# EAGLE schematic Adafruit USB Isolator (EAGLE 9.3.0)
COMPANY: ADAFRUIT INDUSTRIES; DRAWN: KTOWN; REV: B
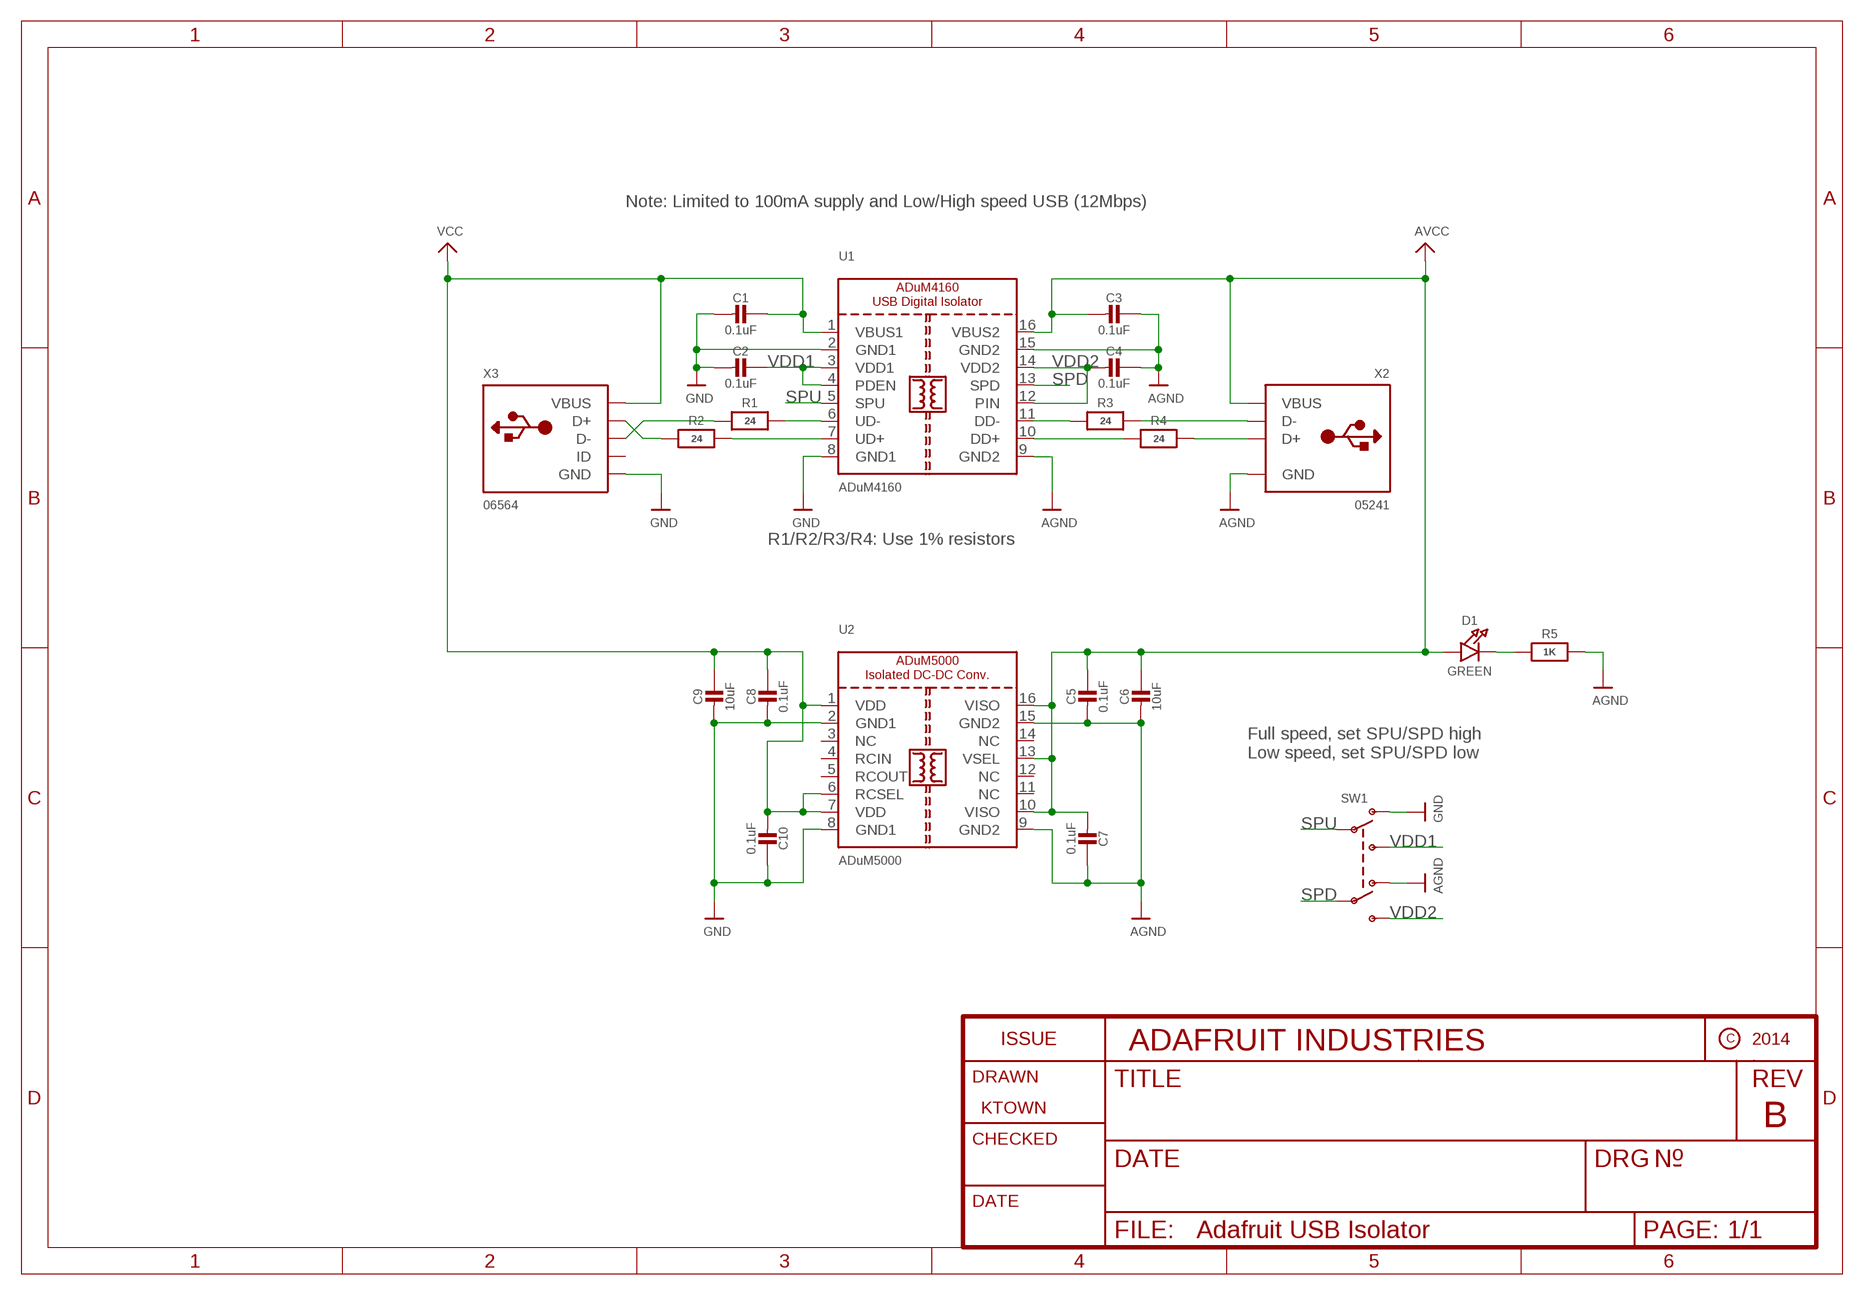
[diagram p0: schematic, sheet 1]

## Parts
C1  0.1uF  CAP_CERAMIC0805-NOOUTLINE  [0805-NO]
C2  0.1uF  CAP_CERAMIC0805-NOOUTLINE  [0805-NO]
C3  0.1uF  CAP_CERAMIC0805-NOOUTLINE  [0805-NO]
C4  0.1uF  CAP_CERAMIC0805-NOOUTLINE  [0805-NO]
C5  0.1uF  CAP_CERAMIC0805-NOOUTLINE  [0805-NO]
C6  10uF  CAP_CERAMIC0805-NOOUTLINE  [0805-NO]
C7  0.1uF  CAP_CERAMIC0805-NOOUTLINE  [0805-NO]
C8  0.1uF  CAP_CERAMIC0805-NOOUTLINE  [0805-NO]
C9  10uF  CAP_CERAMIC0805-NOOUTLINE  [0805-NO]
C10  0.1uF  CAP_CERAMIC0805-NOOUTLINE  [0805-NO]
D1  GREEN  LED0805_NOOUTLINE  [CHIPLED_0805_NOOUTLINE]
R1  24  RESISTOR0805_NOOUTLINE  [0805-NO]
R2  24  RESISTOR0805_NOOUTLINE  [0805-NO]
R3  24  RESISTOR0805_NOOUTLINE  [0805-NO]
R4  24  RESISTOR_0805MP  [_0805MP]
R5  1K  RESISTOR0805_NOOUTLINE  [0805-NO]
SW1  SWITCH_DPDTEG1390  [EG1390]
U1  ADuM4160  ADUM4160  [SOIC16WIDE]
U2  ADuM5000  ADUM5000  [SOIC16WIDE]
X2  05241  USB_TYPEAPTHFML  [USB_HOST-PTH]
X3  06564  USBMINIBLARGE  [USB-MINIB_LARGER]

## Nets
AGND: C3.1 C4.1 C5.2 C6.2 C7.1 R5.2 SW1.O2 U1.9(GND2) U1.15(GND2) U2.9(GND2) U2.15(GND2) X2.GND
AVCC: C3.2 C5.1 C6.1 C7.2 D1.A U1.16(VBUS2) U2.10(VISO) U2.13(VSEL) U2.16(VISO) X2.VBUS
GND: C1.2 C2.2 C8.2 C9.2 C10.1 SW1.O1 U1.2(GND1) U1.8(GND1) U2.2(GND1) U2.8(GND1) X3.GND X3.GND1(GND) X3.GND2(GND) X3.GND3(GND) X3.GND4(GND)
N$1: R2.1 X3.D+
N$2: R2.2 U1.7(UD+)
N$3: R1.2 U1.6(UD-)
N$4: R1.1 X3.D-
N$5: R4.1 U1.10(DD+)
N$6: R4.2 X2.D+
N$7: R3.2 X2.D-
N$8: R3.1 U1.11(DD-)
N$9: D1.C R5.1
SPD: SW1.P2 U1.13(SPD)
SPU: SW1.P1 U1.5(SPU)
VCC: C1.1 C8.1 C9.1 C10.2 U1.1(VBUS1) U2.1(VDD) U2.6(RCSEL) U2.7(VDD) X3.VBUS
VDD1: C2.1 SW1.S1 U1.3(VDD1) U1.4(PDEN)
VDD2: C4.2 SW1.S2 U1.12(PIN) U1.14(VDD2)
Unconnected: U2.3(NC) U2.4(RCIN) U2.5(RCOUT) U2.11(NC) U2.12(NC) U2.14(NC) X3.ID

## Notes on the sheet
- Note: Limited to 100mA supply and Low/High speed USB (12Mbps)
- R1/R2/R3/R4: Use 1% resistors
- Full speed, set SPU/SPD high
  Low speed, set SPU/SPD low

## Library data of the parts
C1-C10 = microbuilder:CAP_CERAMIC: Ceramic Capacitors For new designs, use the packages preceded by an '_' character since they are more reliable: The following footprints should be used on most boards: _0402 - Standard footprint for regular board layouts _0603 - Standard footprint for regular board layouts _0805 - Standard footprint for regular board layouts _1206 - Standard footprint for regular board layouts For extremely tight-pitch boards where space is at a premium, the following 'micro-pitch' footprints can be used (smaller pads, no silkscreen outline, etc.): _0402MP - Micro-pitch footprint for very dense/compact boards _0603MP - Micro-pitch footprint for very dense/compact boards _0805MP - Micro-pitch footprint for very dense/compact boards _1206MP - Micro-pitch footprint for very dense/compact boards
D1 = microbuilder:LED: LED 0603 - 0603 Surface Mount Package 2mA: Green LED - Low Power (3.9mcd, 2ma, 1.7Vf) - Digikey: 475-2709-2-ND Orange LED - Low Power (9.8mcd, 2ma, 1.8Vf) - Digikey: 475-1194-2-ND Red LED - Low Power (5mcd, 2ma, 1.8Vf) - Digikey: 475-1195-2-ND Yellow LED - Low Power (7mcd, 2ma, 1.8Vf) - Digikey: 475-1196-2-ND 5mA: Blue LED - Low Power (17mcd, 5ma, 2.9Vf) - Digikey: LNJ937W8CRACT-ND 0805 - 0805 Surface Mount Package 2mA: Red LED (8.8mcd, 2mA, 1.8Vf, Clear) - Low Power [Digikey: 475-2510-1-ND] Green LED (5mcd, 2mA, 1.8Vf, Clear) - Low Power [Digikey: 475-2730-1-ND] Yellow LED (11.3mcd, 2mA, 1.8Vf, Clear) - Low Power [Digikey: 475-2555-1-ND] 20mA: Red LED (104mcd, 20mA, Diffused) - LS R976 [Digikey: 475-1278-6-ND] Red LED (12mcd, 20mA, 2.0Vf, Clear) - APT2012EC [Digikey: 754-1128-1-ND] Green LED (15mcd, 20mA, 2.2Vf, Clear) - APT2012GC [Digikey: 754-1131-1-ND] Orange LED (160mcd, 20mA, 2.1Vf, Clear) - APT2012SECK [Digikey: 754-1130-1-ND] 1206 - 1206 Surface Mount Package Green LED (26mcd, 20mA, Diffused) - LG N971 [Digikey: 475-1407-6-ND] Red LED (15mcd, 20mA, Diffused) - LH N974 [Digikey: 475-1416-6-ND] Cree - Cree High-Power Surface Mount LEDs XPEBWT-L1-0000-00D50 - White 111lm 350mA 2.9Vf 6200K 110° XTEAWT-00-0000-00000LEE3 - White 114lm 350mA 2.85Vf 5000K 115° Everlight - Everlight 45-21 Series Surface Mount LEDs 45-21/QK2C-B2832AC2CB2/2T - Warm White 2000mcd 20mA 3.25Vf 3050K 120° 45-21/LK2C-B38452C4CB2/2T - Nuetral White 2000mcd 20mA 3.25Vf 4150K 120° 45-21/LK2C-B50634C6CB2/2T - Cold White 2200mcd 20mA 3.25Vf 5650K 120° PLCC2 Reverse Mount LS T77K-J1L2-1-0-2-R18-Z - Red 11.25mcd 2mA 1.8Vf 630nm 120° LO T77K-L1M2-24-Z - Orange 19.6mcd 2mA 1.8Vf 606nm 120° LY T77K-K2M1-26-Z - Yellow 15.7mcd 2mA 1.8Vf 587nm 120°
R1-R5 = microbuilder:RESISTOR: Resistors For new designs, use the packages preceded by an '_' character since they are more reliable: The following footprints should be used on most boards: _0402 - Standard footprint for regular board layouts _0603 - Standard footprint for regular board layouts _0805 - Standard footprint for regular board layouts _1206 - Standard footprint for regular board layouts For extremely tight-pitch boards where space is at a premium, the following 'micro-pitch' footprints can be used (smaller pads, no silkscreen outline, etc.): _0402MP - Micro-pitch footprint for very dense/compact boards _0603MP - Micro-pitch footprint for very dense/compact boards _0805MP - Micro-pitch footprint for very dense/compact boards _1206MP - Micro-pitch footprint for very dense/compact boards
SW1 = microbuilder:SWITCH_DPDT: Switch - DPDT A DPDT Switch acts like an SPDT switch, but has a pair of switches instead of just one. Vertical - 0.3A @ 6V SMT - Digikey: JS202011SCQN
U1 = microbuilder:ADUM4160: ADuM4160 Digital USB Isolator
U2 = microbuilder:ADUM5000: ADuM5000 Isolate DC-to-DC Converter 100mA output Regulated 5.0V or 3.3V output Output Voltage Selection: When VSEL = VISO, output = 5.0V, when VSEL = GND2, output = 3.3V
X2 = microbuilder:USB_TYPEA: USB - Type A Connectors Male types stick out and are inserted into a PC or matching females parts (these are the connectors used on USB Memory Sticks, etc.). Female parts are generally used for USB Host and accept a male-type connector. SMT - 4UCON: 10017 PTHFML - Digikey: 609-1045-ND, 4UCon: 05241 PCB - Use 2.0mm thick PCBs with this footprint
X3 = microbuilder:USB: USB Connectors USBMINIB - Surface Mount Female Mini-B USB Connector 4UConnector: 06564